# Altium schematic sheet 220ACTo5VDC6AUSB_E3.SchDoc
size C
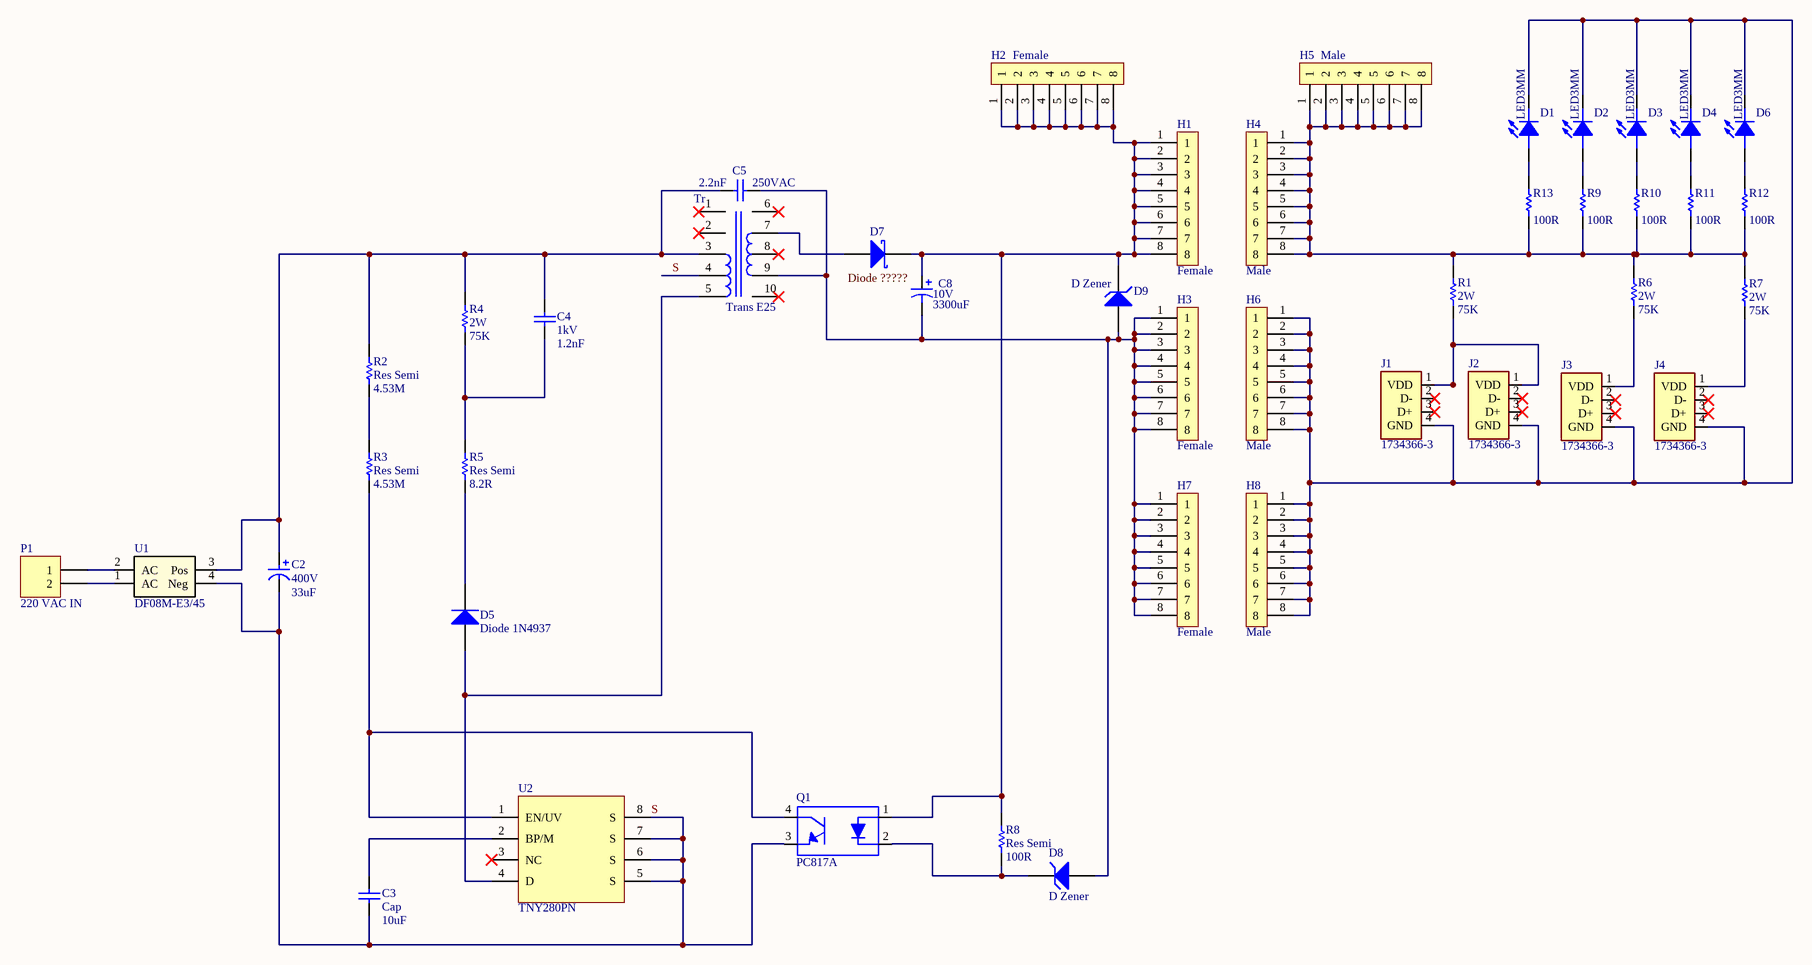
[diagram p0: 220ACTo5VDC6AUSB_E3.SchDoc]

## Parts
C2  400V  value 33uF  [RB7.6_15_400v33uf - duplicate]
C3  Cap  16V: 10uF  [RAD-0.3_Ceramic_CAP]
C4  1kV  1kV: 1.2nF  [RAD-0.3_Ceramic_CAP]
C5  250VAC  250v: 2.2nF  [RAD-0.3_Ceramic_CAP]
C8  10V  value 3300uF  [RB7.6_15_400v33uf]
D1  LED3MM  [LED3mm_GREEN]
D2  LED3MM  [LED3mm_GREEN]
D3  LED3MM  [LED3mm_GREEN]
D4  LED3MM  [LED3mm_GREEN]
D5  Diode 1N4937  [DO-41_1N4006]
D6  LED3MM  [LED3mm_GREEN]
D7  Diode ?????  [DO-41_1N4006]
D8  D Zener  [DO-41_1N4006]
D9  D Zener  [DO-41_1N4006]
H1  Female  [Header1X8 - female]
H2  Female  [Header1X8 - female]
H3  Female  [Header1X8 - female]
H4  Male  [Header1X8 - male]
H5  Male  [Header1X8 - male]
H6  Male  [Header1X8 - male]
H7  Female  [Header1X8 - female]
H8  Male  [Header1X8 - male]
J1  1734366-3  [USB_Vertical]
J2  1734366-3  [USB_Vertical]
J3  1734366-3  [USB_Vertical]
J4  1734366-3  [USB_Vertical]
P1  220 VAC IN  [HDR1X2]
Q1  PC817A  [PC817 Dip]
R1  2W  2W: 75K  [AXIAL-0.5_Res]
R2  Res Semi  value 4.53M  [AXIAL-0.5_Res]
R3  Res Semi  value 4.53M  [AXIAL-0.5_Res]
R4  2W  2W: 75K  [AXIAL-0.5_Res]
R5  Res Semi  value 8.2R  [AXIAL-0.5_Res]
R6  2W  2W: 75K  [AXIAL-0.5_Res]
R7  2W  2W: 75K  [AXIAL-0.5_Res]
R8  Res Semi  value 100R  [AXIAL-0.5_Res]
R9  value 100R  [AXIAL-0.5_Res]  (hidden comment: Res Semi)
R10  value 100R  [AXIAL-0.5_Res]  (hidden comment: Res Semi)
R11  value 100R  [AXIAL-0.5_Res]  (hidden comment: Res Semi)
R12  value 100R  [AXIAL-0.5_Res]  (hidden comment: Res Semi)
R13  value 100R  [AXIAL-0.5_Res]  (hidden comment: Res Semi)
Tr  Trans E25  [Trans]
U1  DF08M-E3/45  [DF08M]
U2  TNY280PN  [DIP762W46P254L988H533Q8]

## Nets
S: C2.2 C3.1 Q1.3 Tr.4 U1.4(Neg) U2.5(S) U2.6(S) U2.7(S) U2.8(S)
NetC2_1: C2.1 C4.2 C5.2 R2.2 R4.2 Tr.3 U1.3(Pos)
NetC3_2: C3.2 U2.2(BP/M)
NetC4_1: C4.1 R4.1 R5.2
NetC5_1: C5.1 C8.2 D8.1(A) D9.1 H3.1 H3.2 H3.3 H3.4 H3.5 H3.6 H3.7 H3.8 H7.1 H7.2 H7.3 H7.4 H7.5 H7.6 H7.7 H7.8 Tr.9
NetC8_1: C8.1 D7.2(K) D9.2 H1.1 H1.2 H1.3 H1.4 H1.5 H1.6 H1.7 H1.8 H2.1 H2.2 H2.3 H2.4 H2.5 H2.6 H2.7 H2.8 Q1.1 R8.2
NetD1_1: D1.1(ANODE) R13.2
NetD1_2: D1.2(CATHODE) D2.2(CATHODE) D3.2(CATHODE) D4.2(CATHODE) D6.2(CATHODE) H6.1 H6.2 H6.3 H6.4 H6.5 H6.6 H6.7 H6.8 H8.1 H8.2 H8.3 H8.4 H8.5 H8.6 H8.7 H8.8 J1.4(GND) J2.4(GND) J3.4(GND) J4.4(GND)
NetD2_1: D2.1(ANODE) R9.2
NetD3_1: D3.1(ANODE) R10.2
NetD4_1: D4.1(ANODE) R11.2
NetD5_1: D5.1(A) Tr.5 U2.4(D)
NetD5_2: D5.2(K) R5.1
NetD6_1: D6.1(ANODE) R12.2
NetD7_1: D7.1(A) Tr.7
NetD8_2: D8.2(K) Q1.2 R8.1
NetH4_1: H4.1 H4.2 H4.3 H4.4 H4.5 H4.6 H4.7 H4.8 H5.1 H5.2 H5.3 H5.4 H5.5 H5.6 H5.7 H5.8 R1.2 R6.2 R7.2 R9.1 R10.1 R11.1 R12.1 R13.1
NetJ1_1: J1.1(VDD) J2.1(VDD) R1.1
NetJ3_1: J3.1(VDD) R6.1
NetJ4_1: J4.1(VDD) R7.1
NetP1_1: P1.1 U1.2(AC)
NetP1_2: P1.2 U1.1(AC)
NetQ1_4: Q1.4 R3.1 U2.1(EN/UV)
NetR2_1: R2.1 R3.2

Not connected (* = marked no-connect by the designer): J1 2(D-)* 3(D+)*; J2 2(D-)* 3(D+)*; J3 2(D-)* 3(D+)*; J4 2(D-)* 3(D+)*; Tr 1* 2* 6* 8* 10*; U2 3(NC)*

## Library data of the parts
C2 C8 = Cap Pol1: Polarized Capacitor (Radial); Published: 8-Jun-2000; LatestRevisionDate: 17-Jul-2002; LatestRevisionNote: Re-released for DXP Platform.; PackageReference: RB7.6-15; Publisher: Altium Limited; PackageDescription: Polarized Capacitor (Radial); 2 Leads
C3-C5 = Cap: Capacitor; Published: 8-Jun-2000; LatestRevisionDate: 17-Jul-2002; LatestRevisionNote: Re-released for DXP Platform.; PackageReference: RAD-0.3; Publisher: Altium Limited; PackageDescription: Radial Cap, Thru-Hole; 2 Leads; 0.3 in Pin Spacing
D1-D4 D6 = LED 3MM: Light Emitting Diode; Designer: Ali Hafizi
D5 = Diode 1N4001: 1 Amp General Purpose Rectifier; Published: 8-Jun-2000; LatestRevisionDate: 17-Jul-2002; LatestRevisionNote: Re-released for DXP Platform.; DatasheetVersion: 1998; PackageVersion: Aug-1999; PackageReference: DO-41; Publisher: Altium Limited; PackageDescription: Diode, Axial; Body 5.2 x 2.7 mm (LxDia. max), Lead Dia. 0.86 mm (max); Code_JEDEC: DO-204-AL; ComponentLink1Description: Manufacturer Link; ComponentLink1URL: http://www.fairchildsemi.com/; ComponentLink2Description: Datasheet; ComponentLink2URL: http://www.fairchildsemi.com/ds/1N%2F1N4001.pdf
D7 = Diode 11DQ03: Schottky Rectifier; Published: 8-Jun-2000; LatestRevisionDate: 17-Jul-2002; LatestRevisionNote: Re-released for DXP Platform.; DatasheetVersion: Dec-1997; PackageReference: DO-204AL; Publisher: Altium Limited; PackageDescription: Diode, Axial; Body 5.2 x 2.7 mm (LxDia. max), Lead Dia. 0.86 mm (max); Code_JEDEC: DO-204-AL; ComponentLink1Description: Manufacturer Link; ComponentLink1URL: http://www.irf.com/; ComponentLink2Description: Datasheet; ComponentLink2URL: http://www.irf.com/product-info/datasheets/data/11dq03.pdf
D8 D9 = D Zener: Zener Diode; Published: 8-Jun-2000; LatestRevisionDate: 17-Jul-2002; LatestRevisionNote: Re-released for DXP Platform.; PackageReference: DIODE-0.7; Publisher: Altium Limited; PackageDescription: Diode, Thru-Hole; 2 Leads; 0.7 in Pin Spacing
H1-H8 = Header-8Pin
J1-J4 = 1734366-3: Conn USB 2.0 Type A RCP 4 POS Solder ST Thru-Hole 4 Terminal 1 Port Box/Tray; MF: TE Connectivity; Price: None; Package: None; Value: *; MP: 1734366-3; Availability: Unavailable; SnapEDA_Link: https://www.snapeda.com/parts/1734366-3/TE%20Connectivity%20AMP%20Connectors/view-part/2506297/?ref=snap
P1 = Header 2: Header, 2-Pin; LatestRevisionDate: 17-Jul-2002; LatestRevisionNote: Re-released for DXP Platform.; Publisher: Altium Limited
Q1 = PC817A: Optoisolator Transistor Output 5000Vrms 1 Channel 4-DIP; MF: Taiwan Semiconductor; Availability: Unavailable; Package: DIP-4 Taiwan Semiconductor; SnapEDA_Link: https://www.snapeda.com/parts/PC817A/Taiwan%20Semiconductor%20Corporation/view-part/2178336/?ref=snap; MP: PC817A; Price: None; Value: *
R1-R13 = Res Semi: Semiconductor Resistor; Published: 8-Jun-2000; LatestRevisionDate: 17-Jul-2002; LatestRevisionNote: Re-released for DXP Platform.; PackageReference: AXIAL-0.5; Publisher: Altium Limited; PackageDescription: Axial Device, Thru-Hole; 2 Leads; 0.5 in Pin Spacing
U1 = DF08M-E3/45: Vendor: VISHAY; Built_By: EMA_UL_Team; SourceLibrary: Vishay_2010-01-01_Comps; Manufacturer_Part_Number: DF08M-E3/45; Copyright: Copyright (C) 2018 Accelerated Designs. All rights reserved; RefDes: RefDes; Type: DEV
U2 = TNY280PN: Dip